# Altium schematic sheet EPS_MPPT_Y_Buck-Boost-Converter.SchDoc: Controlled Buck-Boost Converter CH1
size A4; Date: 2016-01-06; Author: Piotr Kuligowski; Revision: 1-0; SheetTotal: 14; Model: EM1
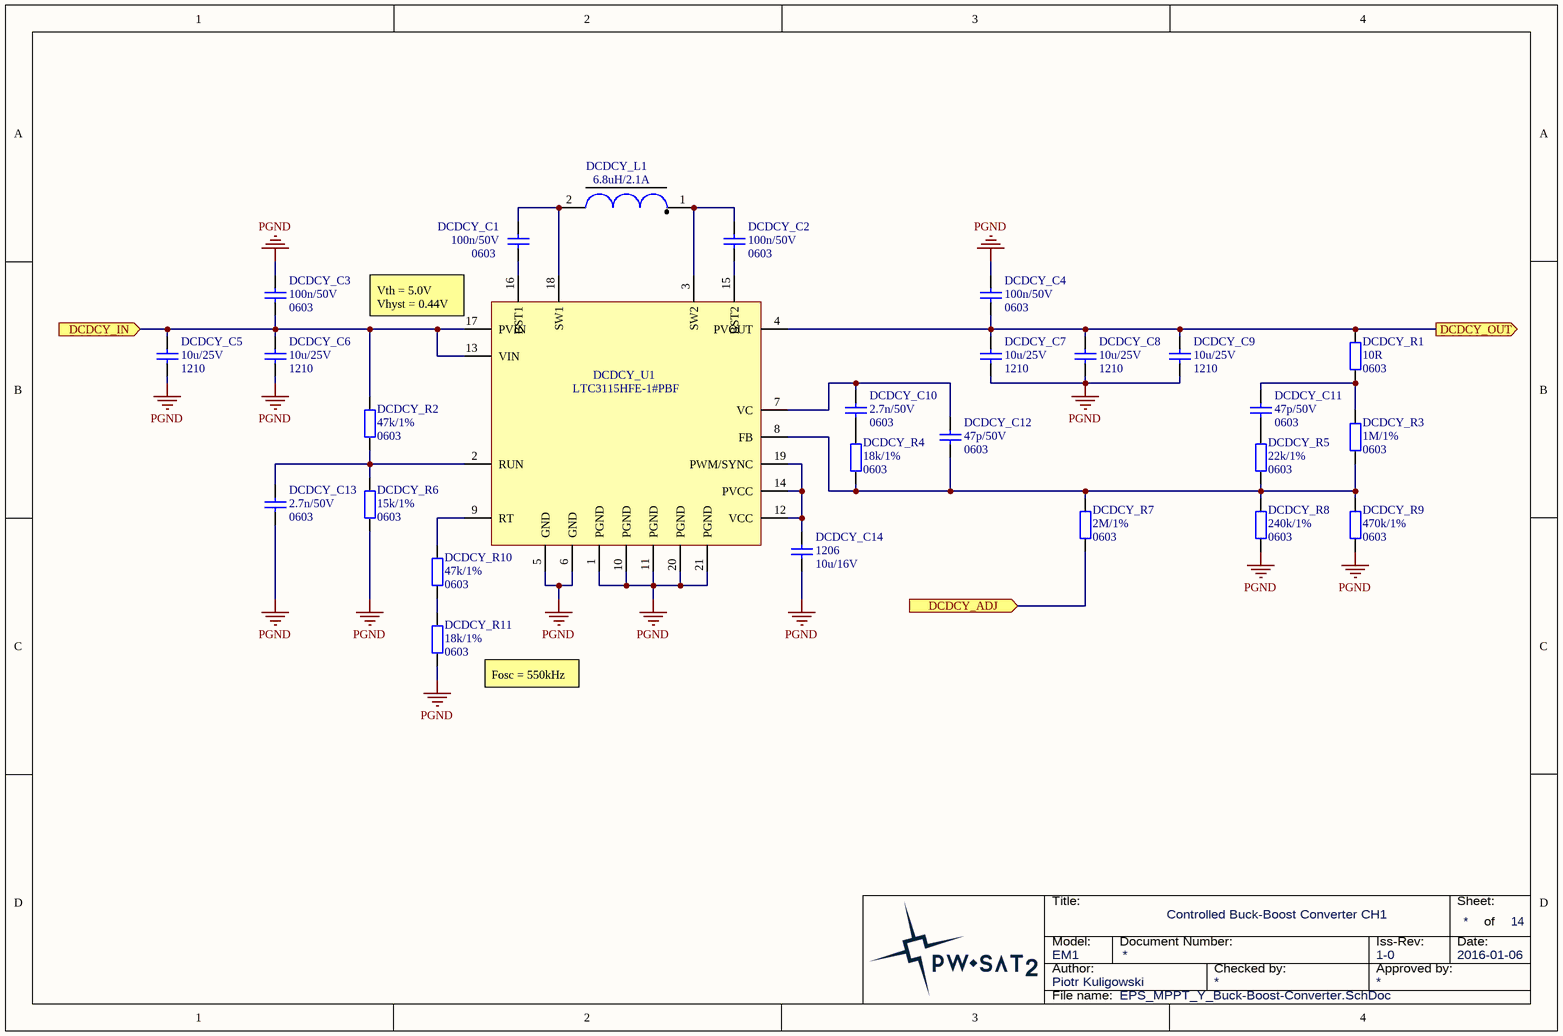
[diagram p0: EPS_MPPT_Y_Buck-Boost-Converter.SchDoc]

## Parts
DCDCY_C1  Package: 0603  [SMD_Capacitor_0603]  (hidden comment: 100n/50V)
DCDCY_C2  Package: 0603  [SMD_Capacitor_0603]  (hidden comment: 100n/50V)
DCDCY_C3  Package: 0603  [SMD_Capacitor_0603]  (hidden comment: 100n/50V)
DCDCY_C4  Package: 0603  [SMD_Capacitor_0603]  (hidden comment: 100n/50V)
DCDCY_C5  Package: 1210  [SMD_Capacitor_1210]  (hidden comment: 10u/25V)
DCDCY_C6  Package: 1210  [SMD_Capacitor_1210]  (hidden comment: 10u/25V)
DCDCY_C7  Package: 1210  [SMD_Capacitor_1210]  (hidden comment: 10u/25V)
DCDCY_C8  Package: 1210  [SMD_Capacitor_1210]  (hidden comment: 10u/25V)
DCDCY_C9  Package: 1210  [SMD_Capacitor_1210]  (hidden comment: 10u/25V)
DCDCY_C10  value 2.7n/50V  Package: 0603  [SMD_Capacitor_0603]  (hidden comment: Cap)
DCDCY_C11  value 47p/50V  Package: 0603  [SMD_Capacitor_0603]  (hidden comment: Cap)
DCDCY_C12  value 47p/50V  Package: 0603  [SMD_Capacitor_0603]  (hidden comment: Cap)
DCDCY_C13  value 2.7n/50V  Package: 0603  [SMD_Capacitor_0603]  (hidden comment: Cap)
DCDCY_C14  Packge: 1206  [SMD_Capacitor_1206]  (hidden comment: 10u/16V)
DCDCY_L1  6.8uH/2.1A  [Coilcraft_MSS6132]
DCDCY_R1  Package: 0603  [SMD_Resistor_0603]  (hidden comment: 10R)
DCDCY_R2  Package: 0603  [SMD_Resistor_0603]  (hidden comment: 47k/1%)
DCDCY_R3  Package: 0603  [SMD_Resistor_0603]  (hidden comment: 1M/1%)
DCDCY_R4  Package: 0603  [SMD_Resistor_0603]  (hidden comment: 18k/1%)
DCDCY_R5  Package: 0603  [SMD_Resistor_0603]  (hidden comment: 22k/1%)
DCDCY_R6  Package: 0603  [SMD_Resistor_0603]  (hidden comment: 15k/1%)
DCDCY_R7  Package: 0603  [SMD_Resistor_0603]  (hidden comment: 2M/1%)
DCDCY_R8  Package: 0603  [SMD_Resistor_0603]  (hidden comment: 240k/1%)
DCDCY_R9  Package: 0603  [SMD_Resistor_0603]  (hidden comment: 470k/1%)
DCDCY_R10  Package: 0603  [SMD_Resistor_0603]  (hidden comment: 47k/1%)
DCDCY_R11  Package: 0603  [SMD_Resistor_0603]  (hidden comment: 18k/1%)
DCDCY_U1  LTC3115HFE-1#PBF  [LT-FE-20-EPV-CA_N]

## Ports
DCDCY_ADJ (in), DCDCY_IN (in), DCDCY_OUT (out)

## Nets
PGND: DCDCY_C3.1 DCDCY_C4.1 DCDCY_C5.2 DCDCY_C6.2 DCDCY_C7.2 DCDCY_C8.2 DCDCY_C9.2 DCDCY_C13.2 DCDCY_C14.2 DCDCY_R6.2 DCDCY_R8.2 DCDCY_R9.2 DCDCY_R11.2 DCDCY_U1.1(PGND) DCDCY_U1.5(GND) DCDCY_U1.6(GND) DCDCY_U1.10(PGND) DCDCY_U1.11(PGND) DCDCY_U1.20(PGND) DCDCY_U1.21(PGND)
DCDCY_ADJ: DCDCY_R7.1 ; port DCDCY_ADJ
DCDCY_IN: DCDCY_C3.2 DCDCY_C5.1 DCDCY_C6.1 DCDCY_R2.1 DCDCY_U1.13(VIN) DCDCY_U1.17(PVIN) ; port DCDCY_IN
DCDCY_OUT: DCDCY_C4.2 DCDCY_C7.1 DCDCY_C8.1 DCDCY_C9.1 DCDCY_R1.1 DCDCY_U1.4(PVOUT) ; port DCDCY_OUT
NetDCDCY_C1_1: DCDCY_C1.1 DCDCY_L1.2 DCDCY_U1.18(SW1)
NetDCDCY_C1_2: DCDCY_C1.2 DCDCY_U1.16(BST1)
NetDCDCY_C2_1: DCDCY_C2.1 DCDCY_L1.1 DCDCY_U1.3(SW2)
NetDCDCY_C2_2: DCDCY_C2.2 DCDCY_U1.15(BST2)
NetDCDCY_C10_1: DCDCY_C10.1 DCDCY_C12.1 DCDCY_U1.7(VC)
NetDCDCY_C10_2: DCDCY_C10.2 DCDCY_R4.1
NetDCDCY_C11_1: DCDCY_C11.1 DCDCY_R1.2 DCDCY_R3.1
NetDCDCY_C11_2: DCDCY_C11.2 DCDCY_R5.1
NetDCDCY_C12_2: DCDCY_C12.2 DCDCY_R3.2 DCDCY_R4.2 DCDCY_R5.2 DCDCY_R7.2 DCDCY_R8.1 DCDCY_R9.1 DCDCY_U1.8(FB)
NetDCDCY_C13_1: DCDCY_C13.1 DCDCY_R2.2 DCDCY_R6.1 DCDCY_U1.2(RUN)
NetDCDCY_C14_1: DCDCY_C14.1 DCDCY_U1.12(VCC) DCDCY_U1.14(PVCC) DCDCY_U1.19(PWM/SYNC)
NetDCDCY_R10_1: DCDCY_R10.1 DCDCY_U1.9(RT)
NetDCDCY_R10_2: DCDCY_R10.2 DCDCY_R11.1

## Notes on the sheet
- (near DCDCY_U1) Vth = 5.0V
  Vhyst = 0.44V
- (near DCDCY_R11) Fosc = 550kHz
- Title:
- Sheet:
- of
- Author:
- Model:
- Document Number:
- Checked by:
- Iss-Rev:
- Approved by:
- Date:
- File name:

## Library data of the parts
DCDCY_C1-DCDCY_C4 = Cer_C0603T104K5RALTU: Ceramic Cap Kemet COTS 100n/50V X7R 0603; Manufacturer: Kemet; ManufacturerPartNumber: C0603T104K5RALTU; Value: 100n/50V
DCDCY_C5-DCDCY_C9 = Cer_GCJ32ER71E106KA12L: Ceramic Cap Murata Automotive 10u/25V X7R 1210; Manufacturer: Murata; ManufacturerPartNumber: GCJ32ER71E106KA12L; Value: 10u/25V
DCDCY_C14 = Cer_C1206T106K4RACTU: Ceramic Cap Kemet COTS 10u/16V X7R 1206; ManufacturerPartNumber: C1206T106K4RACTU; Manufacturer: Kemet; Value: 10u/16V
DCDCY_L1 = MSS6132-682MLx: Coilcraft MSS6132 Inductor, L=6.8uH, Irise20deg=2.1A, ESR=52mR, SRF=47MHz.; Manufacturer: Coilcraft; ManufacturerPartNumber: MSS6132-682MLx; Value: 6.8uH/2.1A
DCDCY_R1-DCDCY_R6 DCDCY_R8-DCDCY_R11 = Res
  DCDCY_R1: Value: 10R
  DCDCY_R2 DCDCY_R10: Value: 47k/1%
  DCDCY_R3: Value: 1M/1%
  DCDCY_R4 DCDCY_R11: Value: 18k/1%
  DCDCY_R5: Value: 22k/1%
  DCDCY_R6: Value: 15k/1%
  DCDCY_R8: Value: 240k/1%
  DCDCY_R9: Value: 470k/1%
DCDCY_R7 = CRCW06032M00FKxxxx: 2M/1% Vishay CRCW 0603 Resistor. 100mW, 200ppm, 75V.; ManufacturerPartNumber: CRCW06032M00FKxxxx; Manufacturer: Vishay; Value: 2M/1%
DCDCY_U1 = LTC3115HFE-1#PBF: 40V, 2A Synchronous Buck-Boost DC/DC Converter, 20-pin SOP (FE-20-EPV-CA), -40 to 150 degC, Pb-Free; Manufacturer: Linear Technology; Package: FE-20-EPV-CA; Value: LTC3115HFE-1#PBF